# EAGLE schematic handle (EAGLE 9.6.1)
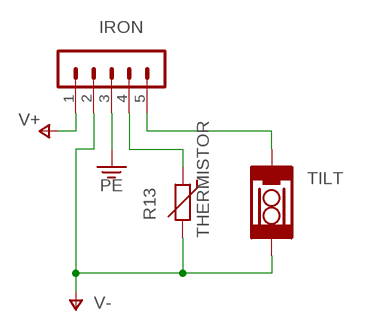
[diagram p0: schematic, sheet 1]

## Parts
IRON  MA05-1  [MA05-1]
R13  THERMISTOR  THERMISTOR_R-5  [R-5]
TILT  SQ-SEN-200  [SQ-SEN-200]

## Nets
3.3V: IRON.3 ; supply symbol labelled PE
N$2: IRON.4 R13.1
N$3: IRON.5 TILT.1
V+: IRON.1
V-: IRON.2 R13.2 TILT.2

## Library data of the parts
IRON = con-lstb:MA05-1: PIN HEADER; OC_FARNELL: unknown; OC_NEWARK: unknown
R13 = discrete:THERMISTOR_: Thermo Resistor
TILT = sensor-signalquest:SQ-SEN-200: TILT AND VIBRATION SENSOR OMNIDIRECTIONAL